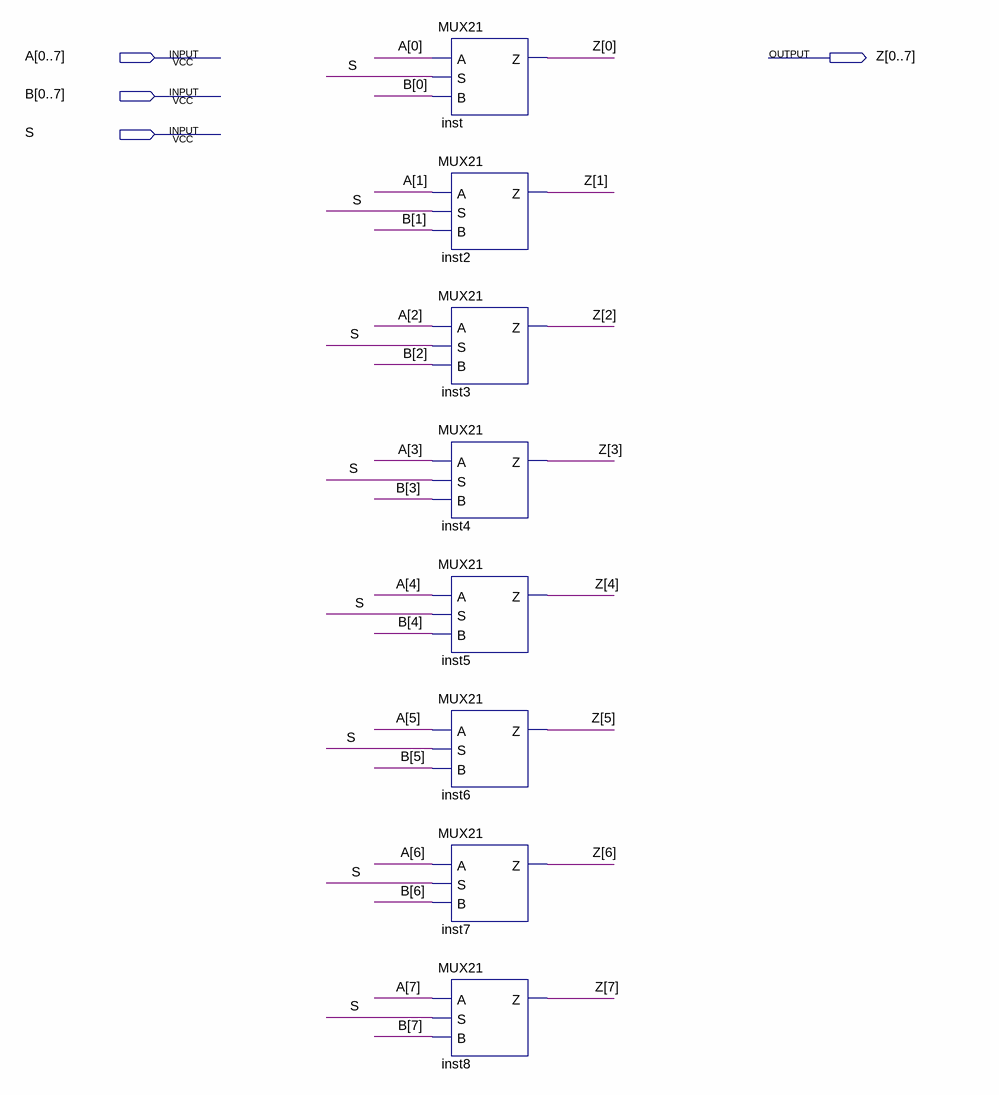
[diagram p0: schematic sheet]
// Quartus schematic LAB2.bdf as structural Verilog: 8 symbols, 4 pins
module LAB2 (
  input  [0:7] A,
  input  [0:7] B,
  input  S,
  output [0:7] Z
);

  MUX21 inst (.A(A[0]), .S(S), .B(B[0]), .Z(Z[0]));
  MUX21 inst2 (.A(A[1]), .S(S), .B(B[1]), .Z(Z[1]));
  MUX21 inst3 (.A(A[2]), .S(S), .B(B[2]), .Z(Z[2]));
  MUX21 inst4 (.A(A[3]), .S(S), .B(B[3]), .Z(Z[3]));
  MUX21 inst5 (.A(A[4]), .S(S), .B(B[4]), .Z(Z[4]));
  MUX21 inst6 (.A(A[5]), .S(S), .B(B[5]), .Z(Z[5]));
  MUX21 inst7 (.A(A[6]), .S(S), .B(B[6]), .Z(Z[6]));
  MUX21 inst8 (.A(A[7]), .S(S), .B(B[7]), .Z(Z[7]));
endmodule
